# Altium project Inverter.PrjPCB
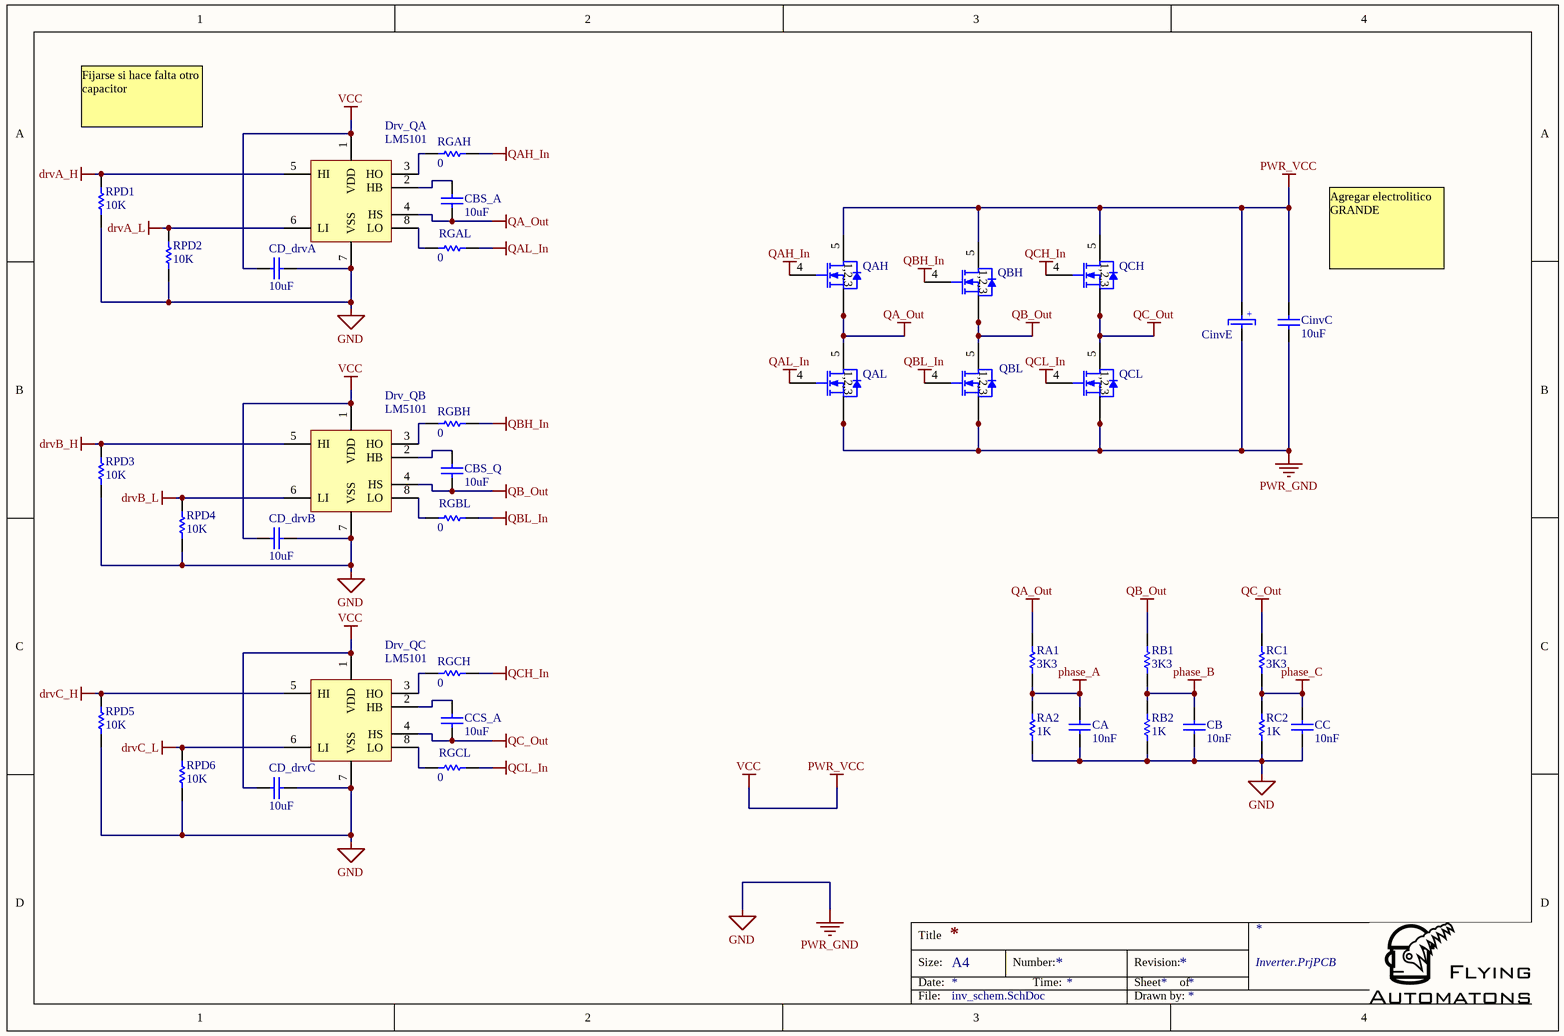
[diagram p0: inv_schem.SchDoc]
2 sheets, 45 parts. Net scope: global (net labels, ports and power ports of the same name join across sheets).
Board file: placaInverter.PcbDoc
Sheets:
  inv_schem.SchDoc
  Connectors.SchDoc

## Sheet inv_schem.SchDoc
size A4

### Parts
CA  10nF  [CAPC1608L]
CB  10nF  [CAPC1608L]
CBS_A  10uF  [CAPC3216L]
CBS_Q  10uF  [CAPC3216L]
CC  10nF  [CAPC1608L]
CCS_A  10uF  [CAPC3216L]
CD_drvA  10uF  [CAPC3216L]
CD_drvB  10uF  [CAPC3216L]
CD_drvC  10uF  [CAPC3216L]
CinvC  10uF  [CAPC3216L]
CinvE  SMD_ECap  [SMD ECap]  (value not drawn)
Drv_QA  LM5101  [JEDEC_MS-012AA]
Drv_QB  LM5101  [JEDEC_MS-012AA]
Drv_QC  LM5101  [JEDEC_MS-012AA]
QAH  (no value)  [x-NXP_LFPAK33]
QAL  (no value)  [x-NXP_LFPAK33]
QBH  (no value)  [x-NXP_LFPAK33]
QBL  (no value)  [x-NXP_LFPAK33]
QCH  (no value)  [x-NXP_LFPAK33]
QCL  (no value)  [x-NXP_LFPAK33]
RA1  3K3  [RESC1608L]
RA2  1K  [RESC1608L]
RB1  3K3  [RESC1608L]
RB2  1K  [RESC1608L]
RC1  3K3  [RESC1608L]
RC2  1K  [RESC1608L]
RGAH  0  [RESC1608L]
RGAL  0  [RESC1608L]
RGBH  0  [RESC1608L]
RGBL  0  [RESC1608L]
RGCH  0  [RESC1608L]
RGCL  0  [RESC1608L]
RPD1  10K  [RESC1608L]
RPD2  10K  [RESC1608L]
RPD3  10K  [RESC1608L]
RPD4  10K  [RESC1608L]
RPD5  10K  [RESC1608L]
RPD6  10K  [RESC1608L]

### Nets
drvA_H: Drv_QA.5(HI) RPD1.1
drvA_L: Drv_QA.6(LI) RPD2.1
drvB_H: Drv_QB.5(HI) RPD3.1
drvB_L: Drv_QB.6(LI) RPD4.1
drvC_H: Drv_QC.5(HI) RPD5.1
drvC_L: Drv_QC.6(LI) RPD6.1
GND: CA.2 CB.2 CC.2 CD_drvA.2 CD_drvB.2 CD_drvC.2 CinvC.2 CinvE.2 Drv_QA.7(VSS) Drv_QB.7(VSS) Drv_QC.7(VSS) QAL.1(S) QAL.2(S) QAL.3(S) QBL.1(S) QBL.2(S) QBL.3(S) QCL.1(S) QCL.2(S) QCL.3(S) RA2.2 RB2.2 RC2.2 RPD1.2 RPD2.2 RPD3.2 RPD4.2 RPD5.2 RPD6.2  [also labelled PWR_GND]
phase_A: CA.1 RA1.2 RA2.1
phase_B: CB.1 RB1.2 RB2.1
phase_C: CC.1 RC1.2 RC2.1
PWR_VCC: CD_drvA.1 CD_drvB.1 CD_drvC.1 CinvC.1 CinvE.1 Drv_QA.1(VDD) Drv_QB.1(VDD) Drv_QC.1(VDD) QAH.5(D) QBH.5(D) QCH.5(D)  [also labelled VCC]
QA_Out: CBS_A.2 Drv_QA.4(HS) QAH.1(S) QAH.2(S) QAH.3(S) QAL.5(D) RA1.1
QAH_In: QAH.4(G) RGAH.1
QAL_In: QAL.4(G) RGAL.1
QB_Out: CBS_Q.2 Drv_QB.4(HS) QBH.1(S) QBH.2(S) QBH.3(S) QBL.5(D) RB1.1
QBH_In: QBH.4(G) RGBH.1
QBL_In: QBL.4(G) RGBL.1
QC_Out: CCS_A.2 Drv_QC.4(HS) QCH.1(S) QCH.2(S) QCH.3(S) QCL.5(D) RC1.1
QCH_In: QCH.4(G) RGCH.1
QCL_In: QCL.4(G) RGCL.1
NetCBS_A_1: CBS_A.1 Drv_QA.2(HB)
NetCBS_Q_1: CBS_Q.1 Drv_QB.2(HB)
NetCCS_A_1: CCS_A.1 Drv_QC.2(HB)
NetDrv_QA_3: Drv_QA.3(HO) RGAH.2
NetDrv_QA_8: Drv_QA.8(LO) RGAL.2
NetDrv_QB_3: Drv_QB.3(HO) RGBH.2
NetDrv_QB_8: Drv_QB.8(LO) RGBL.2
NetDrv_QC_3: Drv_QC.3(HO) RGCH.2
NetDrv_QC_8: Drv_QC.8(LO) RGCL.2

### Notes on the sheet
- Fijarse si hace falta otro capacitor
- Agregar electrolitico GRANDE
- Title
- Size:
- Date:
- A4
- Number:
- Time:
- Revision:
- Sheet
- of
- File:
- Drawn by:
- (in symbol PSMN9R0-25MLC) 1,2,3
- (in symbol SMD_ECap) +

### Library data of the parts
CA CB CC = CAP_100n_0603_50V_Y5V: CAP CER 0.1UF 50V Y5V 0603; Manufacturer Part Number: CC0603ZRY5V9BB104; Value: 100nF; Name: CAP_100n_0603_50V_Y5V; Supplier 1: Digi-Key; Supplier Part Number 1: 311-1343-1-ND
CBS_A CBS_Q CCS_A CD_drvA CD_drvB CD_drvC CinvC = CAP_10u_1206_25V_Y5V: CAP CER 10UF 25V Y5V 1206; Manufacturer Part Number: TMK316F106ZL-T; Name: CAP_10u_1206_25V_Y5V; Value: 10uF; Supplier 1: Digi-Key; Supplier Part Number 1: 587-1353-1-ND
CinvE = SMD_ECap: 100uF
Drv_QA Drv_QB Drv_QC = LM5101: 100V 2A N-Channel MOSFET Gate Driver; Manufacturer Part Number: LM5101BMA-NOPB; Manufacturer: Texas Instruments; Value: 2A, 100V; Name: LM5101; Supplier 1: Texas Instruments
QAH QAL QBH QBL QCH QCL = PSMN9R0-25MLC: TRANSISTOR MOSFET N-CHANN 25V 8.6MOHM; Manufacturer: NXP Semiconductors; Manufacturer Part Number: PSMN9R0-25MLC,115; Name: PSMN9R0-25MLC; Value: PSMN9R0-25MLC; Supplier 1: Digi-Key; Supplier Part Number 1: 568-9578-1-ND
RA1 RA2 RB1 RB2 RC1 RC2 = RES_1K_0603_0W1_1%: RES 1K OHM 1/10W 5% 0603; Manufacturer Part Number: RMCF0603JT1K00; Name: RES_1K_0603_0W1_1%; Value: 1K; Supplier 1: Digi-Key; Supplier Part Number 1: RMCF0603JT1K00CT-ND
RGAH RGAL RGBH RGBL RGCH RGCL = RES_0_0603_0W1_1%: RES 0.0 OHM 1/10W JUMP 0603; Manufacturer Part Number: RC1608J000CS; Name: RES_0_0603_0W1_1%; Value: 0; Supplier 1: Digi-Key; Supplier Part Number 1: 1276-3510-1-ND
RPD1-RPD6 = RES_10K_0603_0W1_1%: RES 10K OHM 1/10W 5% 0603; Manufacturer Part Number: RC1608J103CS; Name: RES_10K_0603_0W1_1%; Value: 10K; Supplier 1: Digi-Key; Supplier Part Number 1: 1276-5086-1-ND

## Sheet Connectors.SchDoc
size A4
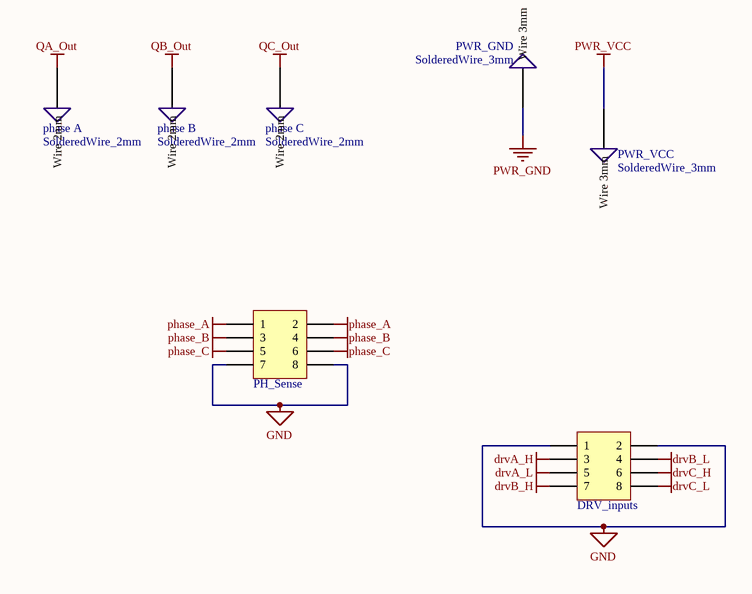
[diagram p1: Connectors.SchDoc]

### Parts
DRV_inputs  HEADER-4x2S  [G-HEADER_4x2I.1P_TH]  (value not drawn)
PH_Sense  HEADER-4x2S  [G-HEADER_4x2I.1P_TH]  (value not drawn)
phase_A  SolderedWire_2mm  [2MM_PAD]
phase_B  SolderedWire_2mm  [2MM_PAD]
phase_C  SolderedWire_2mm  [2MM_PAD]
PWR_GND  SolderedWire_3mm  [3MM_PAD]
PWR_VCC  SolderedWire_3mm  [3MM_PAD]

### Nets
drvA_H: DRV_inputs.3
drvA_L: DRV_inputs.5
drvB_H: DRV_inputs.7
drvB_L: DRV_inputs.4
drvC_H: DRV_inputs.6
drvC_L: DRV_inputs.8
GND: DRV_inputs.1 DRV_inputs.2 PH_Sense.7 PH_Sense.8 PWR_GND.0(Wire_3mm)  [also labelled PWR_GND]
phase_A: PH_Sense.1 PH_Sense.2
phase_B: PH_Sense.3 PH_Sense.4
phase_C: PH_Sense.5 PH_Sense.6
PWR_VCC: PWR_VCC.0(Wire_3mm)
QA_Out: phase_A.0(Wire_2mm)
QB_Out: phase_B.0(Wire_2mm)
QC_Out: phase_C.0(Wire_2mm)

### Notes on the sheet
- Title
- Size:
- Date:
- A4
- Number:
- Time:
- Revision:
- Sheet
- of
- File:
- Drawn by:

### Library data of the parts
DRV_inputs PH_Sense = HEADER_4x2_100mil_F: CONN HEADER FMAL 8PS .1" DL GOLD; Name: HEADER_4x2_100mil_F; Supplier 1: SyC; Supplier Part Number 1: PB08D-H
phase_A phase_B phase_C = SOLDERED_WIRE_2mm: Pad to solder wire; Name: SOLDERED_WIRE_2mm
PWR_GND PWR_VCC = SOLDERED_WIRE_3mm: Pad to solder wire; Name: SOLDERED_WIRE_3mm

## Nets that join several sheets
drvA_H: inv_schem (Drv_QA.5 RPD1.1), Connectors (DRV_inputs.3)
drvA_L: inv_schem (Drv_QA.6 RPD2.1), Connectors (DRV_inputs.5)
drvB_H: inv_schem (Drv_QB.5 RPD3.1), Connectors (DRV_inputs.7)
drvB_L: inv_schem (Drv_QB.6 RPD4.1), Connectors (DRV_inputs.4)
drvC_H: inv_schem (Drv_QC.5 RPD5.1), Connectors (DRV_inputs.6)
drvC_L: inv_schem (Drv_QC.6 RPD6.1), Connectors (DRV_inputs.8)
GND: inv_schem (29 pins), Connectors (5 pins)
phase_A: inv_schem (CA.1 RA1.2 RA2.1), Connectors (PH_Sense.1 PH_Sense.2)
phase_B: inv_schem (CB.1 RB1.2 RB2.1), Connectors (PH_Sense.3 PH_Sense.4)
phase_C: inv_schem (CC.1 RC1.2 RC2.1), Connectors (PH_Sense.5 PH_Sense.6)
PWR_VCC: inv_schem (11 pins), Connectors (PWR_VCC.0)
QA_Out: inv_schem (7 pins), Connectors (phase_A.0)
QB_Out: inv_schem (7 pins), Connectors (phase_B.0)
QC_Out: inv_schem (7 pins), Connectors (phase_C.0)